# EAGLE design bias_generator (EAGLE 9.1.0)
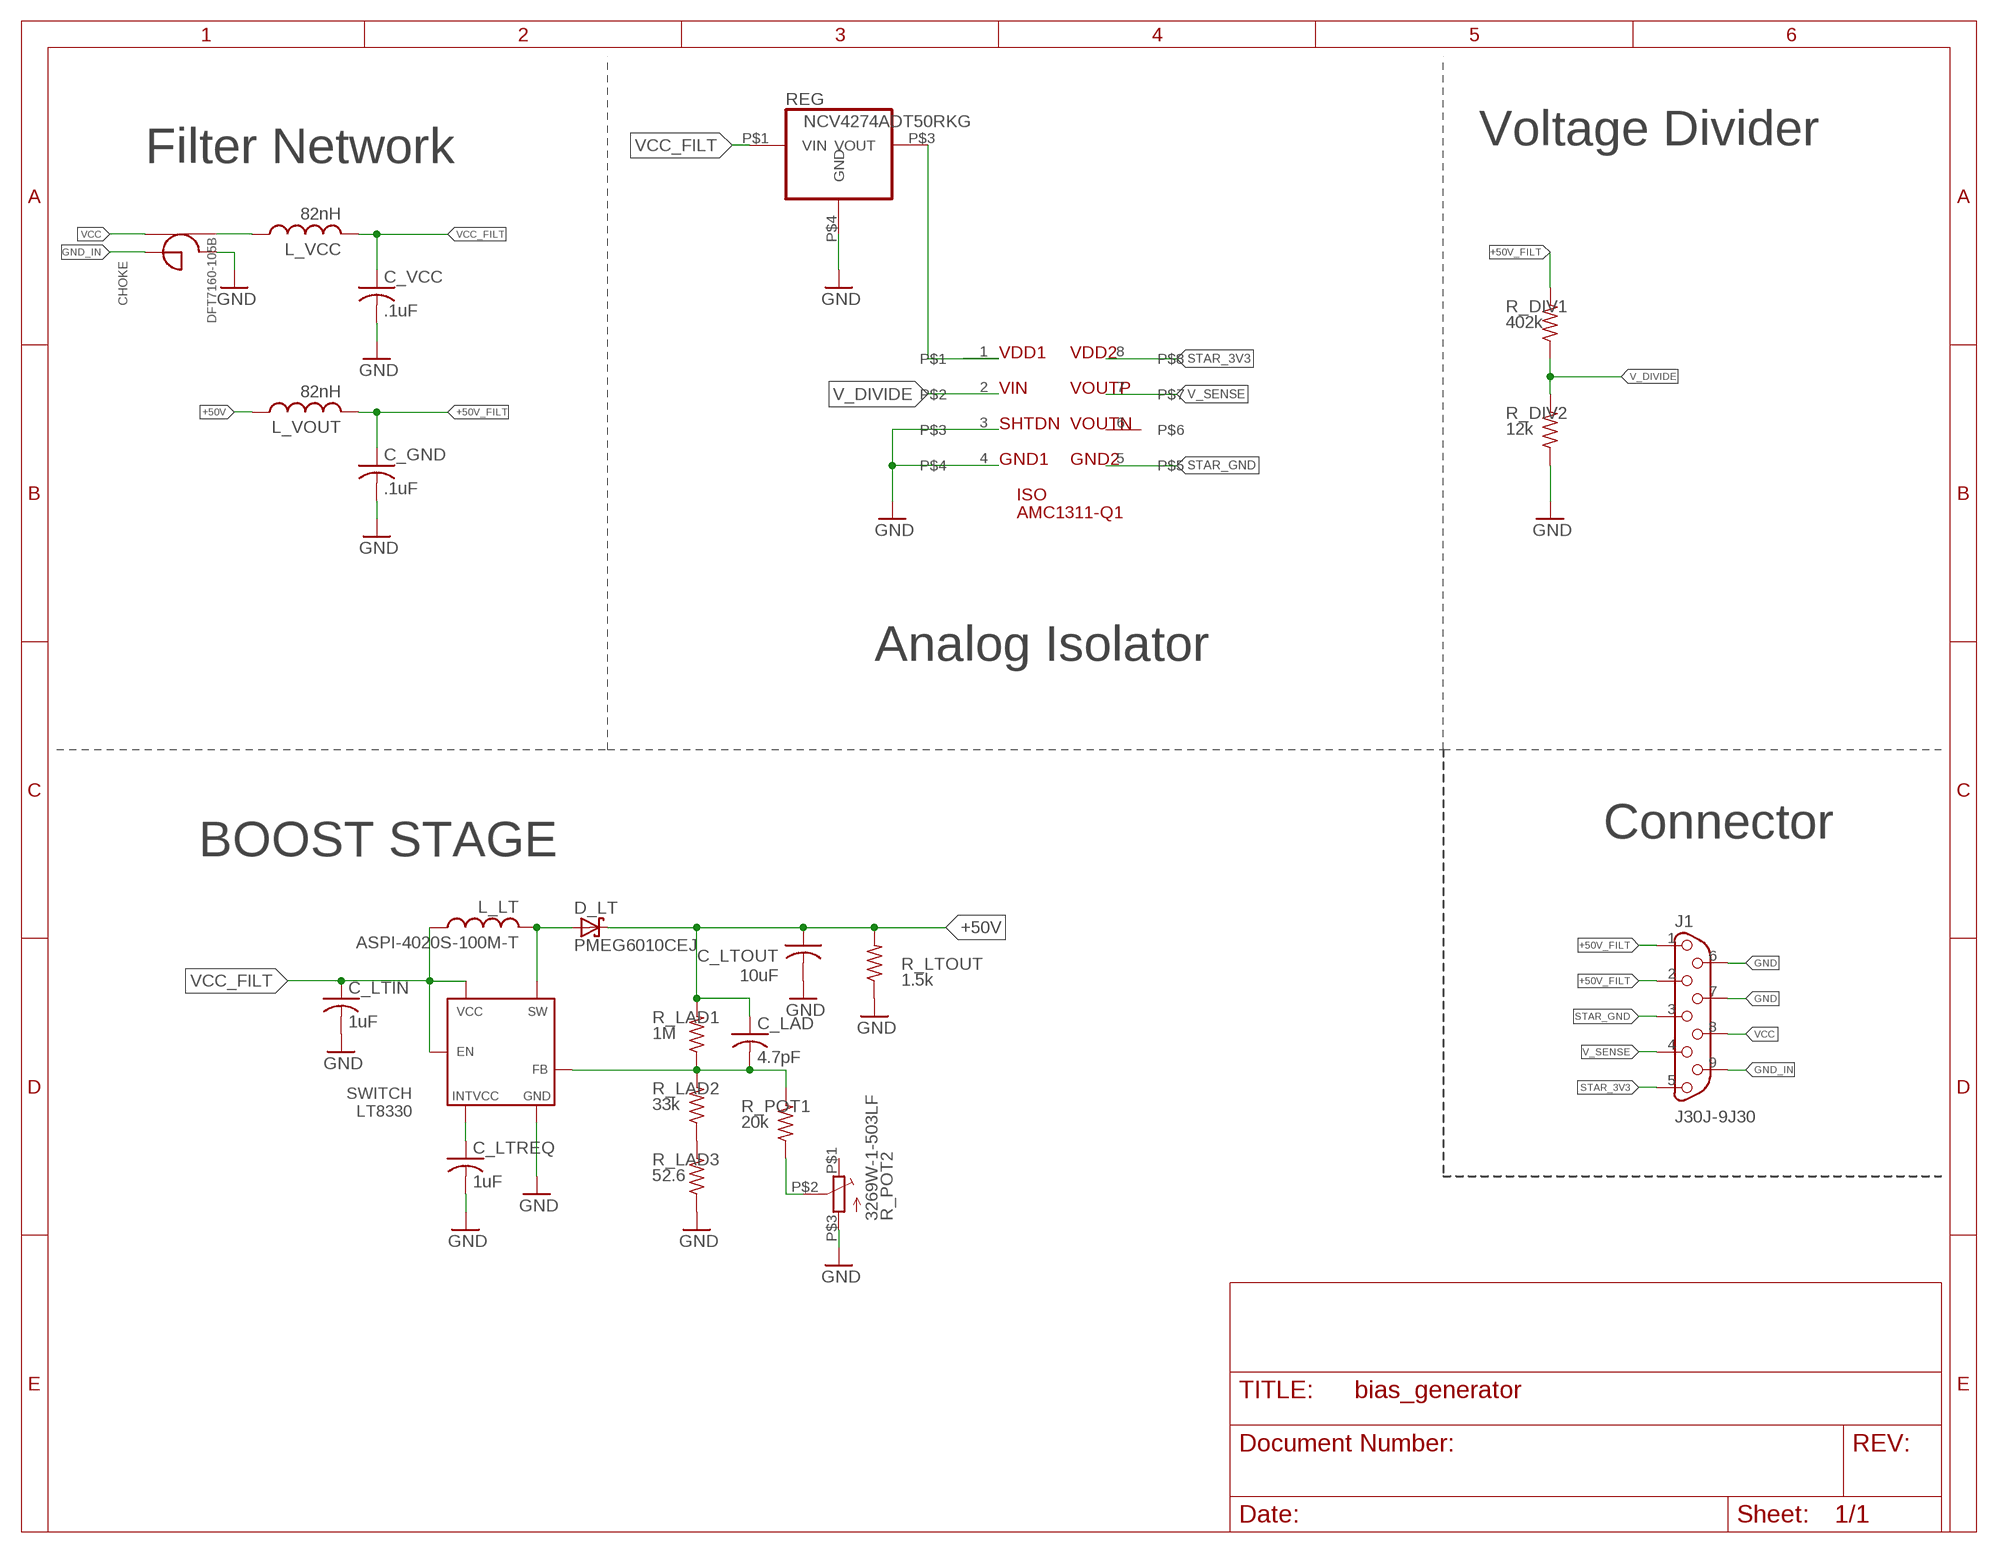
[diagram p0: schematic, sheet 1]

## Parts
C_GND  .1uF  C-USC0603  [C0603]
C_LAD  4.7pF  CAPACITORC0603  [0603]
C_LTIN  1uF  CAPACITORC0603  [0603]
C_LTOUT  10uF  CAPACITOR2-J-LEAD  [2J-LEAD]
C_LTREQ  1uF  CAPACITORC0603  [0603]
C_VCC  .1uF  C-USC0603  [C0603]
CHOKE  DFT7160-105B  [DFT7160]
D_LT  PMEG6010CEJ  SCHOTTKYSOD323  [SOD323]
ISO  AMC1311-Q1  [SOIC8]
J1  J30J-9J30  [ZKN-9-J30]
L_LT  ASPI-4020S-100M-T  [4MM]
L_VCC  82nH  L-US  [C0603]
L_VOUT  82nH  L-US  [C0603]
R_DIV1  402k  R-US_R0603  [R0603]
R_DIV2  12k  R-US_R0603  [R0603]
R_LAD1  1M  R-US_R0603  [R0603]
R_LAD2  33k  R-US_R0603  [R0603]
R_LAD3  52.6  R-US_R0603  [R0603]
R_LTOUT  1.5k  R-US_R2512  [R2512]
R_POT1  20k  R-US_R0603  [R0603]
R_POT2  3269W-1-503LF  [POTENTIOMETER]
REG  NCV4274ADT50RKG  [DPAK]
SWITCH  LT8330  [8-DFN]

## Nets
5V_REG: ISO.1 REG.P$3(VOUT)
+50V: C_LAD.1 C_LTOUT.P$1 D_LT.P$2(C) L_VOUT.1 R_LAD1.2 R_LTOUT.2
+50V_FILT: C_GND.1 J1.1 J1.2 L_VOUT.2 R_DIV1.2
FBX: C_LAD.2 R_LAD1.1 R_LAD2.2 R_POT1.2 SWITCH.P$1(FB)
GND: C_GND.2 C_LTIN.2 C_LTOUT.P$2 C_LTREQ.2 C_VCC.2 CHOKE.P$4(L1OUT) ISO.3 ISO.4 J1.6 J1.7 R_DIV2.1 R_LAD3.1 R_LTOUT.1 R_POT2.P$3 REG.P$4(GND) SWITCH.P$5(GND) SWITCH.P$9(GND)
GND_IN: CHOKE.P$1(L1IN) J1.9
INTVCC: C_LTREQ.1 SWITCH.P$7(INTVCC)
N$1: CHOKE.P$3(L2OUT) L_VCC.1
N$2: R_POT1.1 R_POT2.P$2
N$11: R_LAD2.1 R_LAD3.2
STAR_3V3: ISO.8 J1.5
STAR_GND: ISO.5 J1.3
SW: D_LT.P$1(A) L_LT.P$2 SWITCH.P$3(SW) SWITCH.P$4(SW)
V_DIVIDE: ISO.2 R_DIV1.1 R_DIV2.2
V_SENSE: ISO.7 J1.4
VCC: CHOKE.P$2(L2IN) J1.8
VCC_FILT: C_LTIN.1 C_VCC.1 L_LT.P$1 L_VCC.2 REG.P$1(VIN) SWITCH.P$6(VCC) SWITCH.P$8(EN)
Unconnected: ISO.6 R_POT2.P$1

## Notes on the sheet
- Voltage Divider
- Filter Network
- Analog Isolator
- Connector
- BOOST STAGE

## Library data of the parts
C_GND C_VCC = resistor:C-US: CAPACITOR, American symbol
C_LAD C_LTIN C_LTOUT C_LTREQ = AR_passives:CAPACITOR
CHOKE = Filtering:DFT7160-105B
D_LT = AR_diode:SCHOTTKY
ISO = Filtering:AMC1311-Q1
J1 = CM_J30J:J30J-9
L_LT = AR_passives:ASPI-4020S-100M-T
L_VCC L_VOUT = resistor:L-US: INDUCTOR, American symbol
R_DIV1 R_DIV2 R_LAD1-R_LAD3 R_LTOUT R_POT1 = resistor:R-US_: RESISTOR, American symbol
R_POT2 = Filtering:3269W-1-503LF: Bourns Inc 50k Potentiometer 3269W-1-503LF
REG = Filtering:NCV4274ADT50RKG
SWITCH = AR_IC:LT8330

## Board
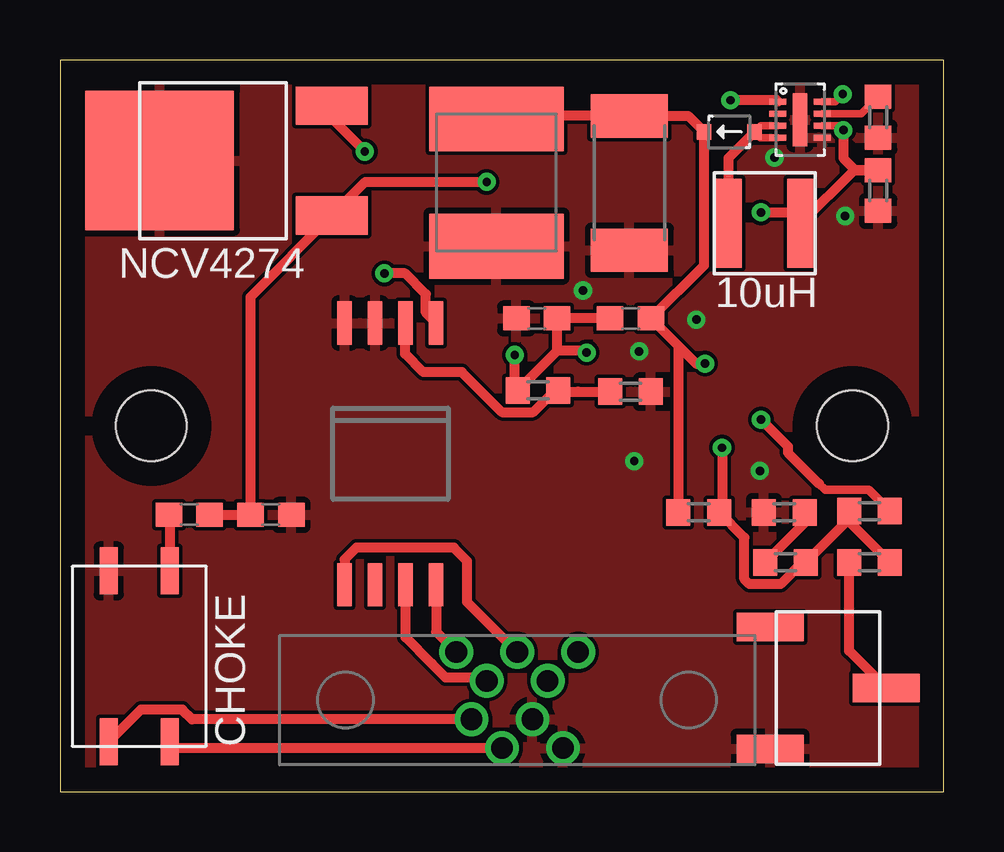
[diagram p1: board, top side]
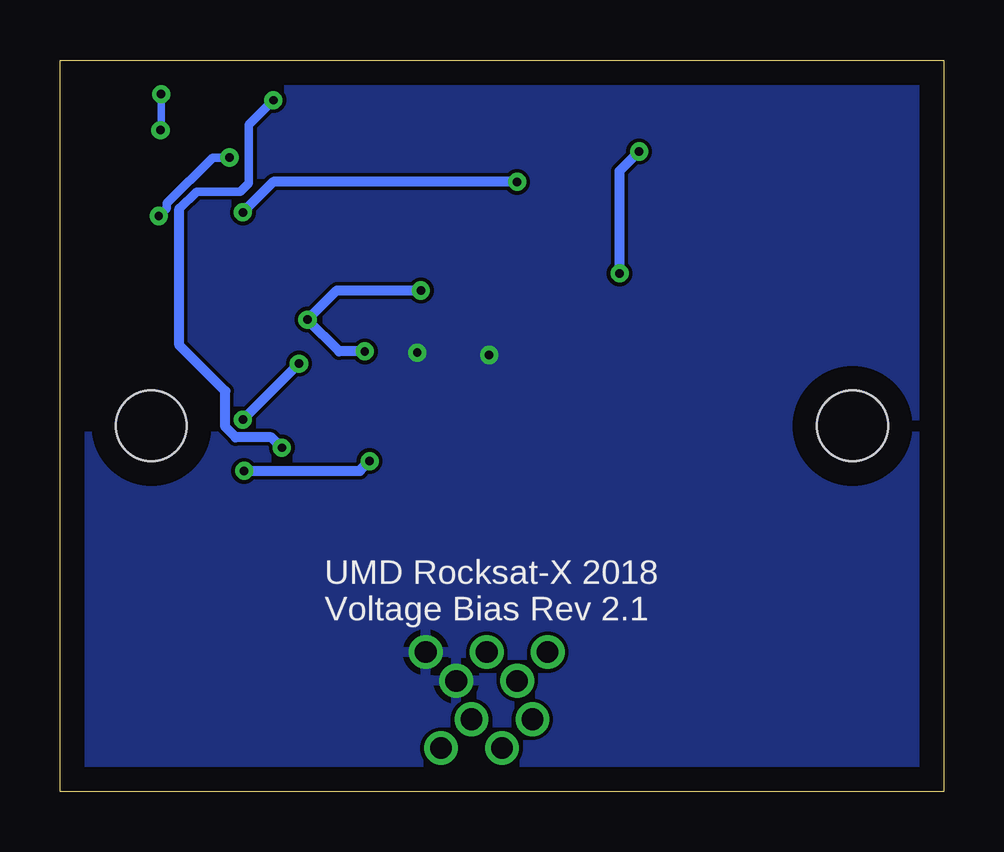
[diagram p2: board, bottom side, seen from below]

Size 36.83 x 30.48 mm. Coordinates in mm from the lower left corner, seen from the top.
Outline: 0,0 36.83,0 36.83,30.48 0,30.48 0,0
Copper layers (1*16): Top 0.035mm / dielectric 1.5mm / Bottom 0.035mm
Design rules "default": minimum track width 6mil, minimum drill 0.35mm, track to track 6mil, track to pad 6mil, pad to pad 6mil, via to via 6mil, smd to smd 6mil, copper to edge 40mil, drill to drill 6mil, minimum pad ring 10mil, minimum via ring 8mil, stop-mask expansion 4mil, vias tented up to drill 0mil, thermal gap 10mil
Holes 2.95 mm at 3.81,15.24 33.02,15.24

### Footprints (pad centres in the part's own frame; a part is rotated, then mirrored left to right if it is on the bottom)
C0603 = smd 1.1 x 1: 1 -0.85,0; 2 0.85,0
0603 = smd 1 x 1.1: 1 -0.85,0; 2 0.85,0
2J-LEAD = smd 2.7 x 5.6: P$1 -2.65,0; P$2 2.65,0
DFT7160 = smd 1.956 x 0.762: P$1 -3.556,1.27; P$2 -3.556,-1.27; P$3 3.556,-1.27; P$4 3.556,1.27
SOD323 = smd 0.6 x 0.66: P$1 -1.05,0; P$2 1.05,0
SOIC8 = smd 0.6 x 1.8: 1 -1.905,-5.45; 2 -0.635,-5.45; 3 0.635,-5.45; 4 1.905,-5.45; 5 1.905,5.45; 6 0.635,5.45; 7 -0.635,5.45; 8 -1.905,5.45
ZKN-9-J30 = drill 0.9: 1 -2.54,-2; 2 -1.27,-0.8; 3 0,-2; 4 1.27,-0.8; 5 2.54,-2; 6 -1.905,2; 7 -0.635,0.8; 8 0.635,2; 9 1.905,0.8
4MM = smd 1.1 x 3.7: P$1 -1.5,0; P$2 1.5,0
R0603 = smd 1 x 1.1: 1 -0.85,0; 2 0.85,0
R2512 = smd 1.8 x 3.2: 1 -2.8,0; 2 2.8,0
POTENTIOMETER = smd 1.19 x 2.79: P$1 -2.54,1.395; P$2 0,6.225; P$3 2.54,1.395
DPAK = smd 3 x 1.6: P$1 -1.5,-2.285; P$3 -1.5,2.285 | smd 6.2 x 5.8: P$4 -8.68,0
8-DFN = smd 0.25 x 0.7: P$1 -0.75,-0.925; P$2 -0.25,-0.925; P$3 0.25,-0.925; P$4 0.75,-0.925; P$5 0.75,0.925; P$6 0.25,0.925; P$7 -0.25,0.925; P$8 -0.75,0.925 | smd 2.2 x 0.61: P$9 0,0

### Placement (x,y rotation side)
C_GND  19.86,19.71 180 top
C_LAD  26.62,11.63 0 top
C_LTIN  34.09,25.04 270 top
C_LTOUT  18.19,25.37 270 top
C_LTREQ  34.09,28.09 270 top
C_VCC  8.79,11.53 0 top
CHOKE  3.3,5.64 90 top
D_LT  27.89,27.48 180 top
ISO  13.77,14.07 180 top
J1  19.05,3.81 180 top
L_LT  29.36,23.67 180 top
L_VCC  5.38,11.53 0 top
L_VOUT  23.77,19.71 180 top
R_DIV1  19.91,16.71 180 top
R_DIV2  23.77,16.66 180 top
R_LAD1  33.73,11.68 0 top
R_LAD2  30.23,9.55 0 top
R_LAD3  30.18,11.63 0 top
R_LTOUT  23.72,25.35 90 top
R_POT1  33.73,9.55 0 top
R_POT2  28.19,4.32 270 top
REG  12.83,26.29 0 top
SWITCH  30.84,27.99 270 top

### Tracks (layer width: path | path; a pad name or v marks a point on that pad's centre or on a via)
5V_REG  (via drill 0.35)
  Top 0.406: v12.7,26.67 11.33,28.04 REG.P$3 | ISO.1 15.24,19.95 15.24,20.73 14.38,21.59 v13.51,21.59
  Bottom 0.406: v13.51,21.59 13.51,25.86 v12.7,26.67
+50V  (via drill 0.35)
  Top 0.356: R_LAD1.2 33.69,12.57 31.88,12.57 31.62,12.83
  Top 0.406: C_LTOUT.P$1 18.27,27.94 18.48,28.15 R_LTOUT.2 26.17,28.15 D_LT.P$2 26.84,21.93 L_VOUT.1 25.34,18.99 | 25.34,18.99 25.77,18.57 C_LAD.1 | 25.34,18.99 26.5,17.83 v26.87,17.83 | v29.21,15.49 30.33,14.38 30.33,14.12 31.62,12.83
  Bottom 0.406: v26.87,17.83 v29.21,15.49
+50V_FILT  (via drill 0.35)
  Top 0.406: L_VOUT.2 C_GND.1 20.71,18.36 | 20.71,18.36 R_DIV1.2 18.95,16.83 v18.95,18.19 | v21.95,18.29 21.87,18.36 20.71,18.36
  pour Bottom: 0,30.48 36.83,30.48 36.83,0 0,0
FBX  (via drill 0.35)
  Top 0.406: R_POT1.2 32.88,11.25 R_LAD1.1 32.88,11.36 R_LAD2.2 30.93,9.55 30.02,8.64 28.73,8.64 28.52,8.85 28.52,10.58 C_LAD.2 27.58,11.75 v27.58,14.33 | SWITCH.P$1 29.85,28.8 v27.94,28.8
  Bottom 0.356: v27.94,28.8 28.96,27.79 28.96,25.35 29.31,24.99 31.14,24.99 31.85,24.28
  Bottom 0.406: 31.85,24.28 31.85,18.59 29.94,16.68 29.94,15.19 29.51,14.76 28.02,14.76 v27.58,14.33
GND  (via drill 0.35)
  Bottom 0.356: v32.72,23.98 32.38,24.31 32.38,24.5 30.47,26.42 v29.77,26.42
  Bottom 0.406: v21.79,20.88 25.3,20.88 v26.52,19.66 25.2,18.34 v24.13,18.34 | v29.16,13.36 24.33,13.36 v23.93,13.77
  pour Top: 0,30.48 36.83,30.48 36.83,0 0,0
GND_IN
  Top 0.406: J1.9 5.51,3.01 5.1,3.42 3.37,3.42 CHOKE.P$1
INTVCC
  Top 0.305: SWITCH.P$7 33.38,28.24 C_LTREQ.1
N$1
  Top 0.406: L_VCC.1 4.57,11.49 CHOKE.P$3
N$2
  Top 0.406: R_POT2.P$2 32.88,5.86 R_POT1.1
N$11
  Top 0.406: R_LAD2.1 31.02,11.2 R_LAD3.2
STAR_3V3
  Top 0.406: ISO.8 15.67,6.65 J1.5
STAR_GND
  Top 0.406: J1.3 16.97,7.89 16.97,9.6 16.41,10.16 12.34,10.16 11.86,9.68 ISO.5
SW
  Top 0.305: SWITCH.P$4 29.18,27.24 D_LT.P$1 29.2,27.74 SWITCH.P$3
  Top 0.406: L_LT.P$2 27.86,26.41 D_LT.P$1
V_DIVIDE
  Top 0.406: R_DIV1.1 20.81,16.66 21.59,16.66 | 21.59,16.66 R_DIV2.2 | 21.59,16.66 20.57,16.66 19.71,15.81 18.42,15.81 16.75,17.48 15.14,17.48 14.38,18.24 14.38,19.5 ISO.2
V_SENSE
  Top 0.406: J1.4 17.64,4.75 16.07,4.75 15.49,5.33 14.4,6.42 ISO.7
VCC
  Top 0.406: J1.8 4.84,1.81 CHOKE.P$2
VCC_FILT  (via drill 0.35)
  Top 0.305: SWITCH.P$8 32.3,28.74 v32.61,29.06 | v32.64,27.56 32.46,27.74 SWITCH.P$6
  Top 0.406: v32.64,27.56 32.64,26.39 33.13,25.89 C_LTIN.1 33.08,25.89 L_LT.P$1 30.41,24.13 v29.21,24.13 | L_VCC.2 C_VCC.1 7.94,20.61 REG.P$1 12.72,25.4 v17.78,25.4
  Bottom 0.305: v32.61,29.06 32.61,27.59 v32.64,27.56
  Bottom 0.406: v17.78,25.4 27.94,25.4 v29.21,24.13

### Text on the board
tPlace: NCV4274 | 10uH
bPlace: UMD Rocksat-X 2018 / Voltage Bias Rev 2.1